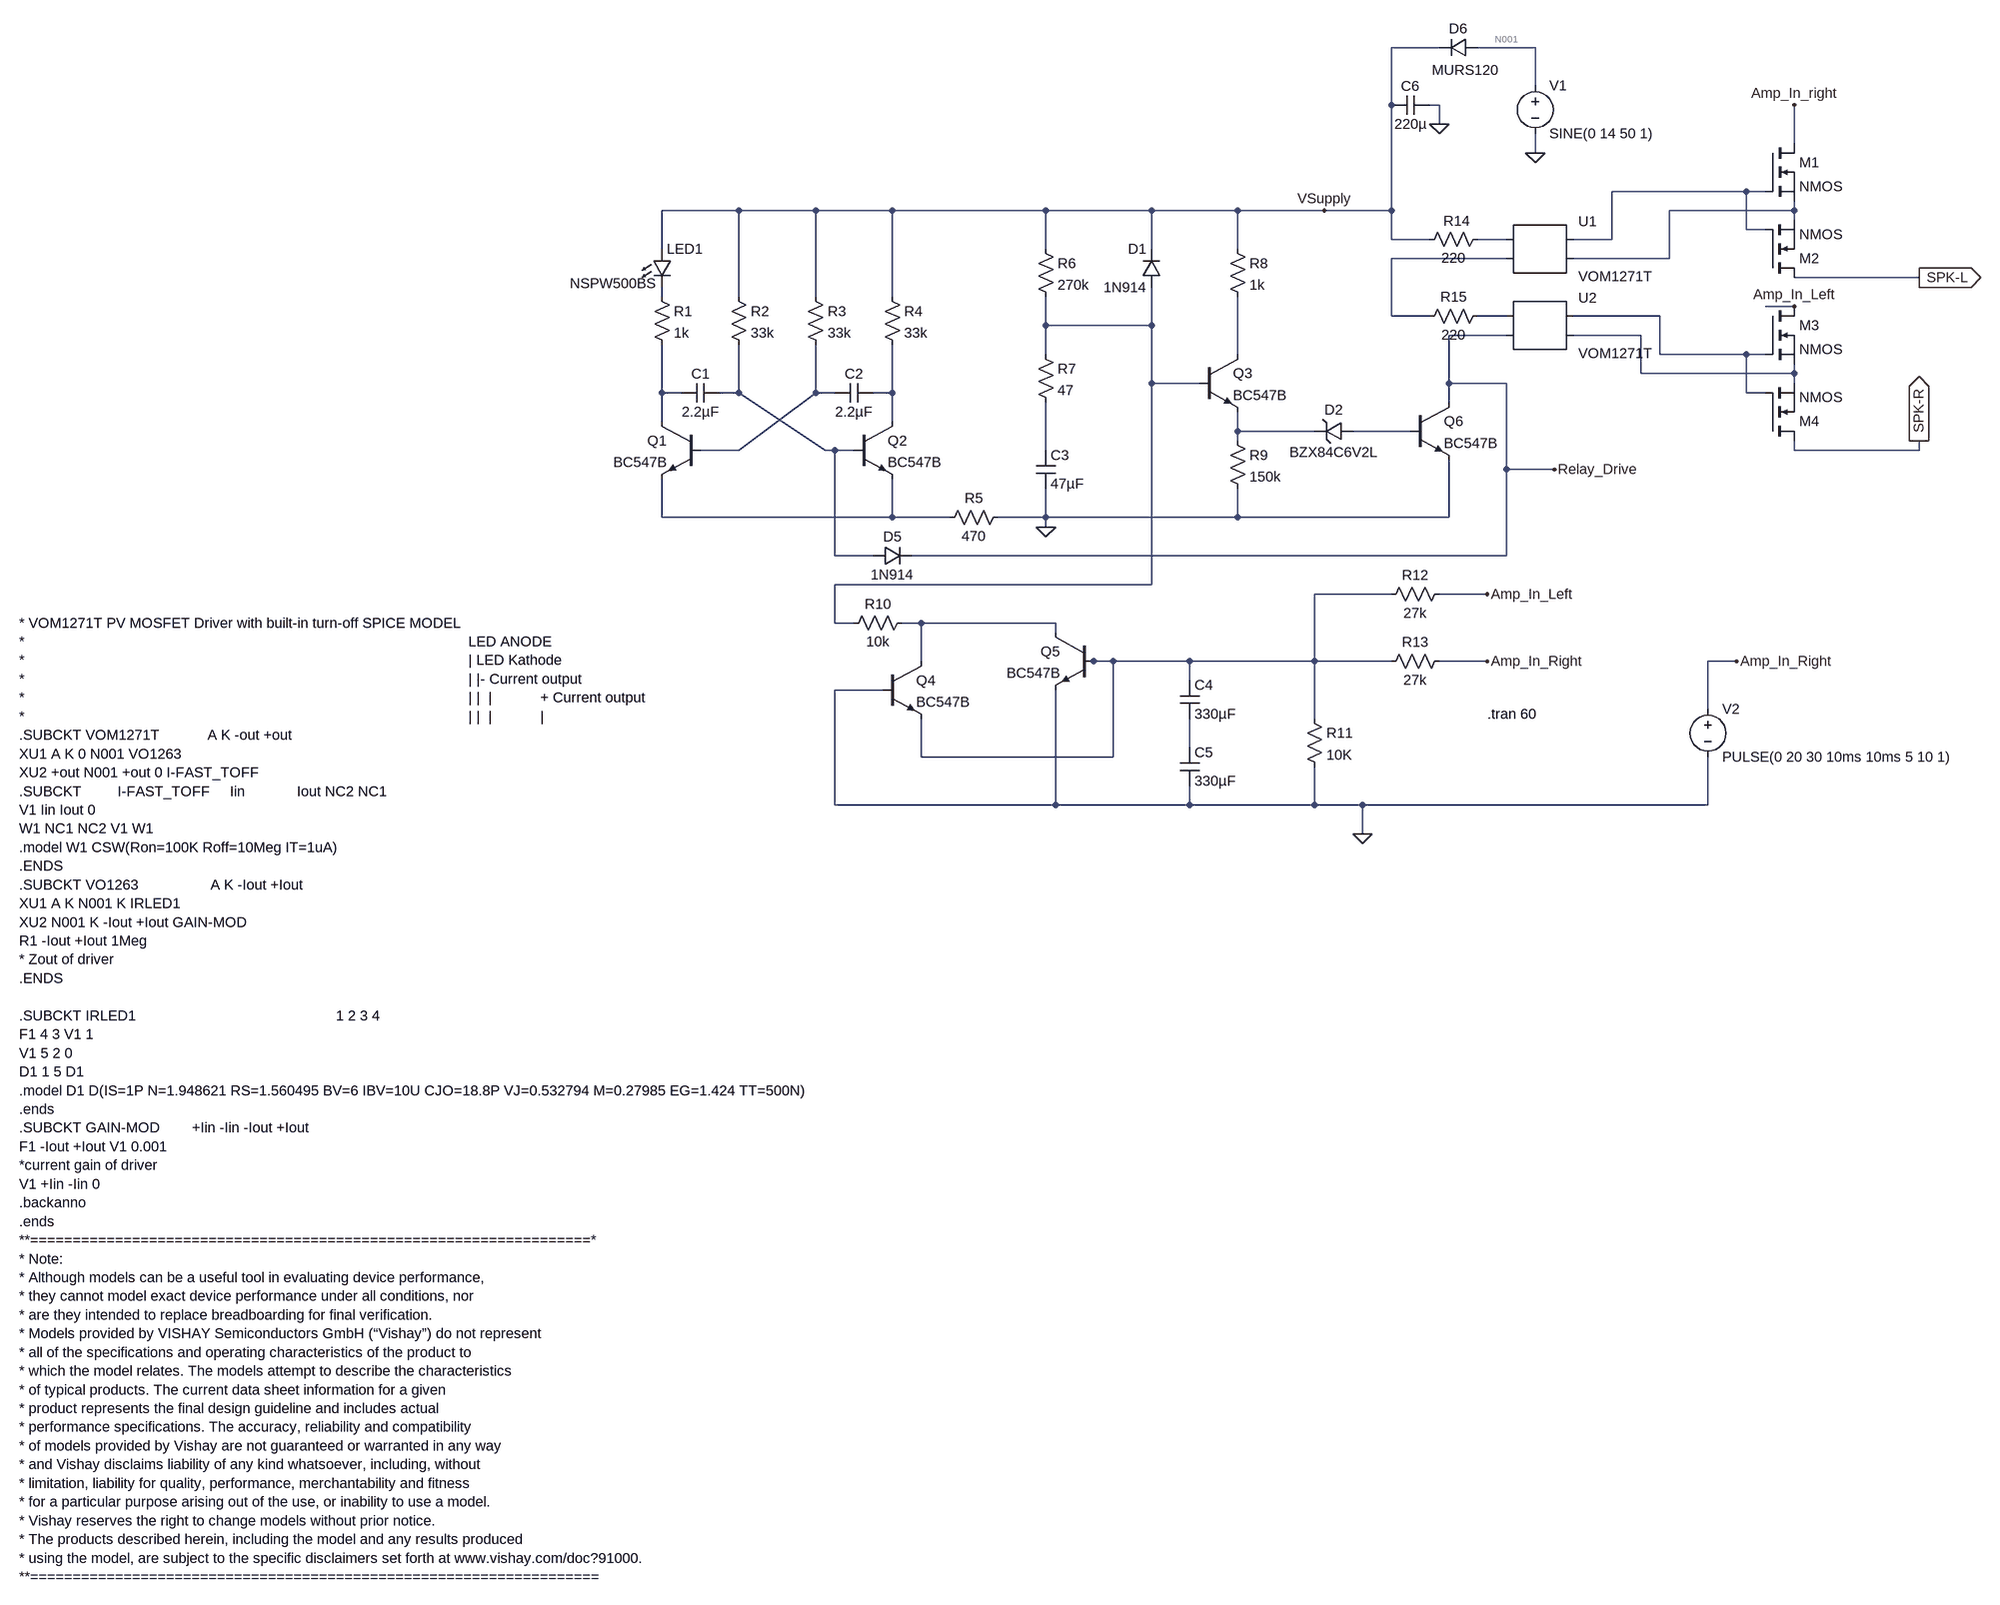
[diagram p0: schematic diyAudio Store Speaker Turn On Delay and DC Protection-VOM1271.asc]
diyAudio Store Speaker Turn On Delay and DC Protection-VOM1271.asc, the LTspice schematic file:
Version 4
SHEET 1 2240 1752
WIRE 1248 -624 1168 -624
WIRE 1408 -624 1312 -624
WIRE 1408 -560 1408 -624
WIRE 1168 -528 1168 -624
WIRE 1248 -528 1232 -528
WIRE 1248 -496 1248 -528
WIRE 1840 -464 1840 -528
WIRE 1408 -448 1408 -480
WIRE 1760 -384 1536 -384
WIRE 1792 -384 1760 -384
WIRE 80 -352 -48 -352
WIRE 208 -352 80 -352
WIRE 336 -352 208 -352
WIRE 592 -352 336 -352
WIRE 768 -352 592 -352
WIRE 912 -352 768 -352
WIRE 1056 -352 912 -352
WIRE 1168 -352 1168 -528
WIRE 1168 -352 1056 -352
WIRE 1840 -352 1840 -368
WIRE 1840 -352 1632 -352
WIRE 1840 -336 1840 -352
WIRE 1760 -320 1760 -384
WIRE 1792 -320 1760 -320
WIRE 1168 -304 1168 -352
WIRE 1232 -304 1168 -304
WIRE 1360 -304 1312 -304
WIRE 1536 -304 1536 -384
WIRE 1536 -304 1472 -304
WIRE -48 -288 -48 -352
WIRE 592 -288 592 -352
WIRE 768 -288 768 -352
WIRE 912 -288 912 -352
WIRE 1360 -272 1168 -272
WIRE 1632 -272 1632 -352
WIRE 1632 -272 1472 -272
WIRE 2048 -240 1840 -240
WIRE -48 -208 -48 -224
WIRE 80 -208 80 -352
WIRE 208 -208 208 -352
WIRE 336 -208 336 -352
WIRE 1840 -192 1792 -192
WIRE 1168 -176 1168 -272
WIRE 1232 -176 1168 -176
WIRE 1360 -176 1312 -176
WIRE 1616 -176 1472 -176
WIRE 592 -160 592 -208
WIRE 768 -160 768 -224
WIRE 768 -160 592 -160
WIRE 1360 -144 1264 -144
WIRE 1584 -144 1472 -144
WIRE 592 -112 592 -160
WIRE 912 -112 912 -208
WIRE 1616 -112 1616 -176
WIRE 1760 -112 1616 -112
WIRE 1792 -112 1760 -112
WIRE 1584 -80 1584 -144
WIRE 1840 -80 1840 -96
WIRE 1840 -80 1584 -80
WIRE 768 -64 768 -160
WIRE 848 -64 768 -64
WIRE 1264 -64 1264 -144
WIRE 1360 -64 1264 -64
WIRE 1840 -64 1840 -80
WIRE -48 -48 -48 -128
WIRE -16 -48 -48 -48
WIRE 80 -48 80 -128
WIRE 80 -48 48 -48
WIRE 208 -48 208 -128
WIRE 240 -48 208 -48
WIRE 336 -48 336 -128
WIRE 336 -48 304 -48
WIRE 1760 -48 1760 -112
WIRE 1792 -48 1760 -48
WIRE 1264 -32 1264 -64
WIRE -48 0 -48 -48
WIRE 336 0 336 -48
WIRE 912 16 912 -16
WIRE 1040 16 912 16
WIRE 1200 16 1104 16
WIRE 912 32 912 16
WIRE 80 48 208 -48
WIRE 80 48 16 48
WIRE 224 48 80 -48
WIRE 240 48 224 48
WIRE 272 48 240 48
WIRE 592 48 592 -32
WIRE 1840 48 1840 32
WIRE 2048 48 2048 32
WIRE 2048 48 1840 48
WIRE 1360 80 1360 -64
WIRE 1440 80 1360 80
WIRE -48 160 -48 96
WIRE 336 160 336 96
WIRE 336 160 -48 160
WIRE 432 160 336 160
WIRE 592 160 592 112
WIRE 592 160 512 160
WIRE 912 160 912 112
WIRE 912 160 592 160
WIRE 1264 160 1264 64
WIRE 1264 160 912 160
WIRE 592 176 592 160
WIRE 240 224 240 48
WIRE 304 224 240 224
WIRE 1360 224 1360 80
WIRE 1360 224 368 224
WIRE 768 272 768 -64
WIRE 768 272 240 272
WIRE 1168 288 1040 288
WIRE 1328 288 1248 288
WIRE 240 336 240 272
WIRE 272 336 240 336
WIRE 384 336 352 336
WIRE 608 336 384 336
WIRE 608 352 608 336
WIRE 384 400 384 336
WIRE 672 400 656 400
WIRE 704 400 672 400
WIRE 832 400 704 400
WIRE 1040 400 1040 288
WIRE 1040 400 832 400
WIRE 1168 400 1040 400
WIRE 1328 400 1248 400
WIRE 1744 400 1696 400
WIRE 832 432 832 400
WIRE 320 448 240 448
WIRE 1696 480 1696 400
WIRE 1040 496 1040 400
WIRE 832 544 832 496
WIRE 384 560 384 496
WIRE 704 560 704 400
WIRE 704 560 384 560
WIRE 240 640 240 448
WIRE 608 640 608 448
WIRE 608 640 240 640
WIRE 832 640 832 608
WIRE 832 640 608 640
WIRE 1040 640 1040 576
WIRE 1040 640 832 640
WIRE 1120 640 1040 640
WIRE 1696 640 1696 560
WIRE 1696 640 1120 640
WIRE 1120 688 1120 640
FLAG 592 176 0
FLAG 1328 288 Amp_In_Left
FLAG 1328 400 Amp_In_Right
FLAG 1120 688 0
FLAG 1744 400 Amp_In_Right
FLAG 1056 -352 VSupply
FLAG 1440 80 Relay_Drive
FLAG 1408 -448 0
FLAG 2048 -240 SPK-L
IOPIN 2048 -240 Out
FLAG 2048 32 SPK-R
IOPIN 2048 32 Out
FLAG 1840 -528 Amp_In_right
FLAG 1840 -192 Amp_In_Left
FLAG 1248 -496 0
SYMBOL npn 16 0 M0
SYMATTR InstName Q1
SYMATTR Value BC547B
SYMBOL npn 272 0 R0
SYMATTR InstName Q2
SYMATTR Value BC547B
SYMBOL res -64 -224 R0
SYMATTR InstName R1
SYMATTR Value 1k
SYMBOL res 64 -224 R0
SYMATTR InstName R2
SYMATTR Value 33k
SYMBOL res 192 -224 R0
SYMATTR InstName R3
SYMATTR Value 33k
SYMBOL res 320 -224 R0
SYMATTR InstName R4
SYMATTR Value 33k
SYMBOL LED -64 -288 R0
WINDOW 3 -138 58 Left 2
SYMATTR Value NSPW500BS
SYMATTR InstName LED1
SYMBOL cap 48 -64 R90
WINDOW 0 0 32 VBottom 2
WINDOW 3 32 32 VTop 2
SYMATTR InstName C1
SYMATTR Value 2.2µF
SYMBOL cap 304 -64 R90
WINDOW 0 0 32 VBottom 2
WINDOW 3 32 32 VTop 2
SYMATTR InstName C2
SYMATTR Value 2.2µF
SYMBOL res 528 144 R90
WINDOW 0 0 56 VBottom 2
WINDOW 3 32 56 VTop 2
SYMATTR InstName R5
SYMATTR Value 470
SYMBOL cap 576 48 R0
SYMATTR InstName C3
SYMATTR Value 47µF
SYMBOL res 576 -128 R0
SYMATTR InstName R7
SYMATTR Value 47
SYMBOL res 576 -304 R0
SYMATTR InstName R6
SYMATTR Value 270k
SYMBOL diode 784 -224 R180
WINDOW 0 24 64 Left 2
WINDOW 3 24 0 Left 2
SYMATTR InstName D1
SYMATTR Value 1N914
SYMBOL npn 848 -112 R0
SYMATTR InstName Q3
SYMATTR Value BC547B
SYMBOL res 896 -304 R0
SYMATTR InstName R8
SYMATTR Value 1k
SYMBOL res 896 16 R0
SYMATTR InstName R9
SYMATTR Value 150k
SYMBOL zener 1104 0 R90
WINDOW 0 -4 32 VBottom 2
WINDOW 3 36 32 VTop 2
SYMATTR InstName D2
SYMATTR Value BZX84C6V2L
SYMBOL npn 1200 -32 R0
SYMATTR InstName Q6
SYMATTR Value BC547B
SYMBOL diode 1312 -640 R90
WINDOW 0 0 32 VBottom 2
WINDOW 3 38 21 VTop 2
SYMATTR InstName D6
SYMATTR Value MURS120
SYMBOL voltage 1408 -576 R0
WINDOW 123 0 0 Left 0
WINDOW 39 0 0 Left 0
SYMATTR InstName V1
SYMATTR Value SINE(0 14 50 1)
SYMBOL npn 320 400 R0
SYMATTR InstName Q4
SYMATTR Value BC547B
SYMBOL npn 672 352 M0
SYMATTR InstName Q5
SYMATTR Value BC547B
SYMBOL res 368 320 R90
WINDOW 0 0 56 VBottom 2
WINDOW 3 32 56 VTop 2
SYMATTR InstName R10
SYMATTR Value 10k
SYMBOL cap 816 432 R0
SYMATTR InstName C4
SYMATTR Value 330µF
SYMBOL cap 816 544 R0
SYMATTR InstName C5
SYMATTR Value 330µF
SYMBOL res 1024 480 R0
SYMATTR InstName R11
SYMATTR Value 10K
SYMBOL res 1264 272 R90
WINDOW 0 0 56 VBottom 2
WINDOW 3 32 56 VTop 2
SYMATTR InstName R12
SYMATTR Value 27k
SYMBOL res 1264 384 R90
WINDOW 0 0 56 VBottom 2
WINDOW 3 32 56 VTop 2
SYMATTR InstName R13
SYMATTR Value 27k
SYMBOL voltage 1696 464 R0
WINDOW 123 0 0 Left 0
WINDOW 39 0 0 Left 0
SYMATTR InstName V2
SYMATTR Value PULSE(0 20 30 10ms 10ms 5 10 1)
SYMBOL diode 304 240 R270
WINDOW 0 32 32 VTop 2
WINDOW 3 0 32 VBottom 2
SYMATTR InstName D5
SYMATTR Value 1N914
SYMBOL AutoGenerated\\VOM1271T 1408 -288 R0
SYMATTR InstName U1
SYMBOL AutoGenerated\\VOM1271T 1408 -160 R0
SYMATTR InstName U2
SYMBOL res 1328 -320 R90
WINDOW 0 1 51 VBottom 2
WINDOW 3 32 56 VTop 2
SYMATTR InstName R14
SYMATTR Value 220
SYMBOL res 1328 -192 R90
WINDOW 0 0 56 VBottom 2
WINDOW 3 32 56 VTop 2
SYMATTR InstName R15
SYMATTR Value 220
SYMBOL nmos 1792 -464 R0
SYMATTR InstName M1
SYMBOL nmos 1792 -192 R0
SYMATTR InstName M3
SYMBOL nmos 1792 -240 M180
SYMATTR InstName M2
SYMBOL nmos 1792 32 M180
SYMATTR InstName M4
SYMBOL cap 1232 -544 R90
WINDOW 0 0 32 VBottom 2
WINDOW 3 32 32 VTop 2
SYMATTR InstName C6
SYMATTR Value 220µ
TEXT 1328 488 Left 2 !.tran 60
TEXT -1120 336 Left 2 !* VOM1271T PV MOSFET Driver with built-in turn-off SPICE MODEL\n*                                                                                                               LED ANODE\n*                                                                                                               | LED Kathode\n*                                                                                                               | |- Current output\n*                                                                                                               | |  |            + Current output\n*                                                                                                               | |  |            |\n.SUBCKT VOM1271T            A K -out +out\nXU1 A K 0 N001 VO1263\nXU2 +out N001 +out 0 I-FAST_TOFF\n.SUBCKT         I-FAST_TOFF     Iin             Iout NC2 NC1\nV1 Iin Iout 0\nW1 NC1 NC2 V1 W1\n.model W1 CSW(Ron=100K Roff=10Meg IT=1uA)\n.ENDS\n.SUBCKT VO1263                  A K -Iout +Iout\nXU1 A K N001 K IRLED1\nXU2 N001 K -Iout +Iout GAIN-MOD\nR1 -Iout +Iout 1Meg\n* Zout of driver\n.ENDS\n\n.SUBCKT IRLED1                                                  1 2 3 4\nF1 4 3 V1 1\nV1 5 2 0\nD1 1 5 D1\n.model D1 D(IS=1P N=1.948621 RS=1.560495 BV=6 IBV=10U CJO=18.8P VJ=0.532794 M=0.27985 EG=1.424 TT=500N)\n.ends\n.SUBCKT GAIN-MOD        +Iin -Iin -Iout +Iout\nF1 -Iout +Iout V1 0.001\n*current gain of driver\nV1 +Iin -Iin 0\n.backanno\n.ends\n**==================================================================*\n* Note:\n* Although models can be a useful tool in evaluating device performance,\n* they cannot model exact device performance under all conditions, nor\n* are they intended to replace breadboarding for final verification.\n* Models provided by VISHAY Semiconductors GmbH (“Vishay”) do not represent\n* all of the specifications and operating characteristics of the product to\n* which the model relates. The models attempt to describe the characteristics\n* of typical products. The current data sheet information for a given\n* product represents the final design guideline and includes actual\n* performance specifications. The accuracy, reliability and compatibility\n* of models provided by Vishay are not guaranteed or warranted in any way\n* and Vishay disclaims liability of any kind whatsoever, including, without\n* limitation, liability for quality, performance, merchantability and fitness\n* for a particular purpose arising out of the use, or inability to use a model.\n* Vishay reserves the right to change models without prior notice.\n* The products described herein, including the model and any results produced\n* using the model, are subject to the specific disclaimers set forth at www.vishay.com/doc?91000.\n**===================================================================

The netlist it stands for:
* diyAudio Store Speaker Turn On Delay and DC Protection-VOM1271.asc
Q1 N012 N014 N019 0 BC547B
Q2 N015 N013 N019 0 BC547B
R1 N006 N012 1k
R2 VSupply N013 33k
R3 VSupply N014 33k
R4 VSupply N015 33k
D§LED1 VSupply N006 NSPW500BS
C1 N013 N012 2.2µF
C2 N015 N014 2.2µF
R5 0 N019 470
C3 N018 0 47µF
R7 N009 N018 47
R6 VSupply N009 270k
D1 N009 VSupply 1N914
Q3 N011 N009 N016 0 BC547B
R8 VSupply N011 1k
R9 N016 0 150k
D2 N017 N016 BZX84C6V2L
Q6 Relay_Drive N017 0 0 BC547B
D6 N001 VSupply MURS120
V1 N001 0 SINE(0 14 50 1)
Q4 N021 0 N020 0 BC547B
Q5 N021 N020 0 0 BC547B
R10 N021 N009 10k
C4 N020 N022 330µF
C5 N022 0 330µF
R11 N020 0 10K
R12 Amp_In_Left N020 27k
R13 Amp_In_Right N020 27k
V2 Amp_In_Right 0 PULSE(0 20 30 10ms 10ms 5 10 1)
D5 N013 Relay_Drive 1N914
* U1: VOM1271T (symbol AutoGenerated\VOM1271T not available, pins judged from their places): A=N004 K=N005 -out=N002 +out=N003
* U2: VOM1271T (symbol AutoGenerated\VOM1271T not available, pins judged from their places): A=N007 K=Relay_Drive -out=N008 +out=N010
R14 N004 VSupply 220
R15 N007 N005 220
M1 Amp_In_Right N002 N003 N003 NMOS
M3 Amp_In_Left N008 N010 N010 NMOS
M2 SPK-L N002 N003 N003 NMOS
M4 SPK-R N008 N010 N010 NMOS
C6 0 VSupply 220µ
.model D D
.lib standard.dio
.model NPN NPN
.model PNP PNP
.lib standard.bjt
.model NMOS NMOS
.model PMOS PMOS
.lib standard.mos
.tran 60
* VOM1271T PV MOSFET Driver with built-in turn-off SPICE MODEL
*                                                                                                               LED ANODE
*                                                                                                               | LED Kathode
*                                                                                                               | |- Current output
*                                                                                                               | |  |            + Current output
*                                                                                                               | |  |            |
.SUBCKT VOM1271T            A K -out +out
XU1 A K 0 N001 VO1263
XU2 +out N001 +out 0 I-FAST_TOFF
.SUBCKT         I-FAST_TOFF     Iin             Iout NC2 NC1
V1 Iin Iout 0
W1 NC1 NC2 V1 W1
.model W1 CSW(Ron=100K Roff=10Meg IT=1uA)
.ENDS
.SUBCKT VO1263                  A K -Iout +Iout
XU1 A K N001 K IRLED1
XU2 N001 K -Iout +Iout GAIN-MOD
R1 -Iout +Iout 1Meg
* Zout of driver
.ENDS
.SUBCKT IRLED1                                                  1 2 3 4
F1 4 3 V1 1
V1 5 2 0
D1 1 5 D1
.model D1 D(IS=1P N=1.948621 RS=1.560495 BV=6 IBV=10U CJO=18.8P VJ=0.532794 M=0.27985 EG=1.424 TT=500N)
.ends
.SUBCKT GAIN-MOD        +Iin -Iin -Iout +Iout
F1 -Iout +Iout V1 0.001
*current gain of driver
V1 +Iin -Iin 0
.backanno
.ends
**==================================================================*
* Note:
* Although models can be a useful tool in evaluating device performance,
* they cannot model exact device performance under all conditions, nor
* are they intended to replace breadboarding for final verification.
* Models provided by VISHAY Semiconductors GmbH (“Vishay”) do not represent
* all of the specifications and operating characteristics of the product to
* which the model relates. The models attempt to describe the characteristics
* of typical products. The current data sheet information for a given
* product represents the final design guideline and includes actual
* performance specifications. The accuracy, reliability and compatibility
* of models provided by Vishay are not guaranteed or warranted in any way
* and Vishay disclaims liability of any kind whatsoever, including, without
* limitation, liability for quality, performance, merchantability and fitness
* for a particular purpose arising out of the use, or inability to use a model.
* Vishay reserves the right to change models without prior notice.
* The products described herein, including the model and any results produced
* using the model, are subject to the specific disclaimers set forth at www.vishay.com/doc?91000.
**===================================================================
.backanno
.end